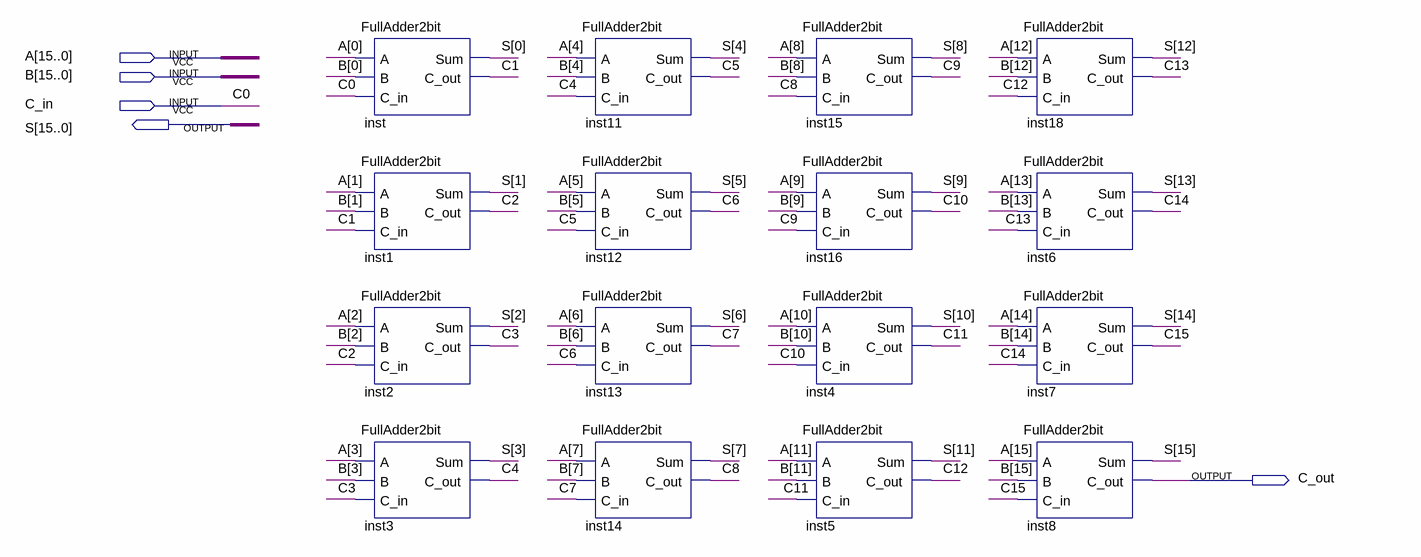
[diagram p0: schematic sheet]
// Quartus schematic FullAdder16bit.bdf as structural Verilog: 16 symbols, 5 pins
module FullAdder16bit (
  input  [15:0] A,
  input  [15:0] B,
  input  C_in,
  output [15:0] S,
  output C_out
);

  wire C1, C2, C3, C4, C5, C6, C7, C8, C9, C10, C11, C12, C13, C14, C15;

  FullAdder2bit inst (.A(A[0]), .B(B[0]), .C_in(C_in), .Sum(S[0]), .C_out(C1));
  FullAdder2bit inst1 (.A(A[1]), .B(B[1]), .C_in(C1), .Sum(S[1]), .C_out(C2));
  FullAdder2bit inst2 (.A(A[2]), .B(B[2]), .C_in(C2), .Sum(S[2]), .C_out(C3));
  FullAdder2bit inst3 (.A(A[3]), .B(B[3]), .C_in(C3), .Sum(S[3]), .C_out(C4));
  FullAdder2bit inst11 (.A(A[4]), .B(B[4]), .C_in(C4), .Sum(S[4]), .C_out(C5));
  FullAdder2bit inst12 (.A(A[5]), .B(B[5]), .C_in(C5), .Sum(S[5]), .C_out(C6));
  FullAdder2bit inst13 (.A(A[6]), .B(B[6]), .C_in(C6), .Sum(S[6]), .C_out(C7));
  FullAdder2bit inst14 (.A(A[7]), .B(B[7]), .C_in(C7), .Sum(S[7]), .C_out(C8));
  FullAdder2bit inst15 (.A(A[8]), .B(B[8]), .C_in(C8), .Sum(S[8]), .C_out(C9));
  FullAdder2bit inst16 (.A(A[9]), .B(B[9]), .C_in(C9), .Sum(S[9]), .C_out(C10));
  FullAdder2bit inst4 (.A(A[10]), .B(B[10]), .C_in(C10), .Sum(S[10]), .C_out(C11));
  FullAdder2bit inst5 (.A(A[11]), .B(B[11]), .C_in(C11), .Sum(S[11]), .C_out(C12));
  FullAdder2bit inst18 (.A(A[12]), .B(B[12]), .C_in(C12), .Sum(S[12]), .C_out(C13));
  FullAdder2bit inst6 (.A(A[13]), .B(B[13]), .C_in(C13), .Sum(S[13]), .C_out(C14));
  FullAdder2bit inst7 (.A(A[14]), .B(B[14]), .C_in(C14), .Sum(S[14]), .C_out(C15));
  FullAdder2bit inst8 (.A(A[15]), .B(B[15]), .C_in(C15), .Sum(S[15]), .C_out(C_out));

  // Other names for the same wires on the sheet: C0 = C_in
endmodule
